# EAGLE schematic openevse-ac-filter-v1.1 (EAGLE 7.7.0)
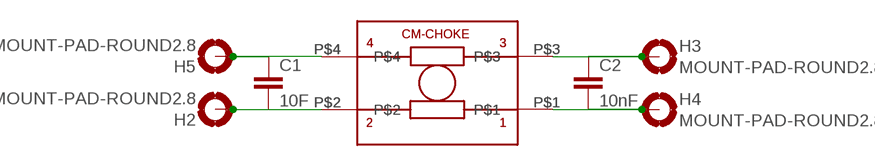
[diagram p0: schematic, sheet 1]

## Parts
C1  10F  C5/2.5  [C5B2.5]
C2  10nF  C5/2.5  [C5B2.5]
H2  MOUNT-PAD-ROUND2.8  [2,8-PAD]
H3  MOUNT-PAD-ROUND2.8  [2,8-PAD]
H4  MOUNT-PAD-ROUND2.8  [2,8-PAD]
H5  MOUNT-PAD-ROUND2.8  [2,8-PAD]
U$1  47mH  RN114-0.3-02-47M  [RN114-0.3-02-47M]
U$2  RN214-0.3-02-47M  [RN214-0.3-02-47M]

## Nets
N$1: C1.1 H5.B2,8(MOUNT) U$1.P$4 U$2.P$4
N$2: C1.2 H2.B2,8(MOUNT) U$1.P$2 U$2.P$2
N$3: C2.1 H3.B2,8(MOUNT) U$1.P$3 U$2.P$3
N$4: C2.2 H4.B2,8(MOUNT) U$1.P$1 U$2.P$1

## Library data of the parts
C1 C2 = capacitor-wima:C: CAPACITOR naming: grid - package width
H2-H5 = holes:MOUNT-PAD-ROUND: MOUNTING PAD, round
U$1 = Schaffner-CM-Choke:RN114-0.3-02-47M
U$2 = Schaffner-CM-Choke:RN214-0.3-02-47M